# Altium schematic sheet 树莓派F1C100S.SchDoc
size A4
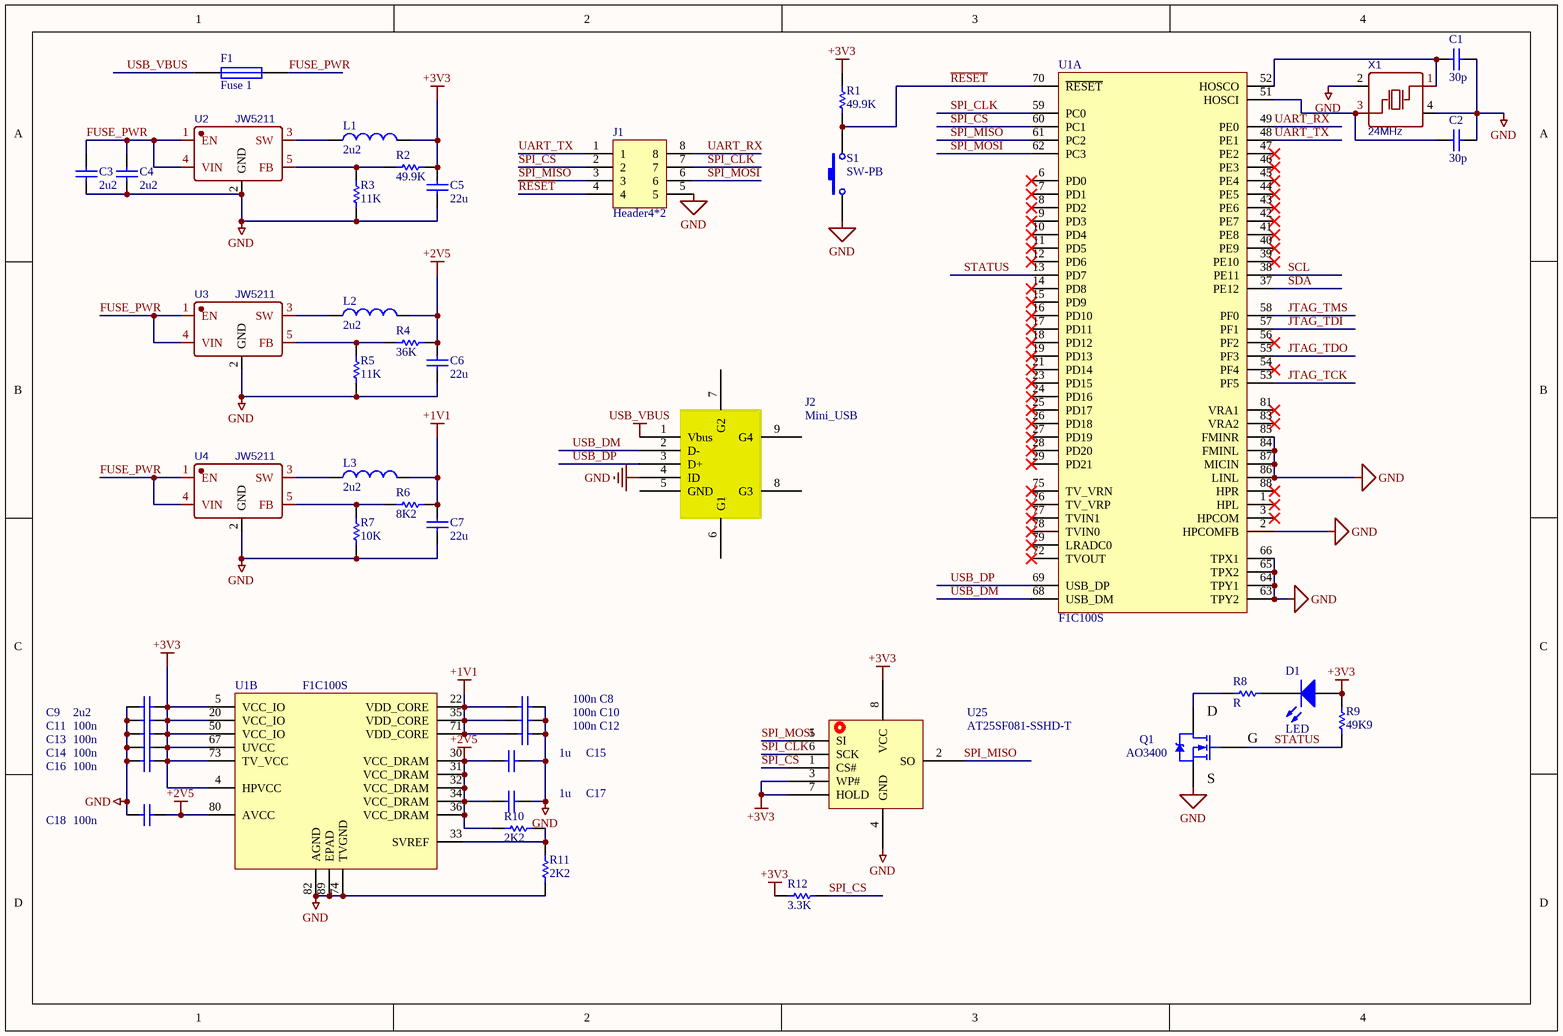
[diagram p0: 树莓派F1C100S.SchDoc]

## Parts
C1  30p  [C0805]
C2  30p  [C0805]
C3  2u2  [C0805]
C4  2u2  [C0805]
C5  22u  [C0805]
C6  22u  [C0805]
C7  22u  [C0805]
C8  100n  [C0805]
C9  2u2  [C0805]
C10  100n  [C0805]
C11  100n  [C0805]
C12  100n  [C0805]
C13  100n  [C0805]
C14  100n  [C0805]
C15  1u  [C0805]
C16  100n  [C0805]
C17  1u  [C0805]
C18  100n  [C0805]
D1  LED  [LED-0805]
F1  Fuse 1  [polyfuse]
J1  Header4*2  [HDR2X4]
J2  Mini_USB  [MINi_USB_2]
L1  2u2  [R0805]
L2  2u2  [R0805]
L3  2u2  [R0805]
Q1  AO3400  [SOT-23]
R1  49.9K  [R0805]
R2  49.9K  [R0805]
R3  11K  [R0805]
R4  36K  [R0805]
R5  11K  [R0805]
R6  8K2  [R0805]
R7  10K  [R0805]
R8  R  [R0805]
R9  49K9  [R0805]
R10  2K2  [R0805]
R11  2K2  [R0805]
R12  3.3K  [R0805]
S1  SW-PB  [SW-2]
U1  F1C100S  [QFN-88]  (parts A,B of 2)
U2  JW5211  [SOT-23-5]
U3  JW5211  [SOT-23-5]
U4  JW5211  [SOT-23-5]
U25  AT25SF081-SSHD-T  [AT25SF081-SSHD-T]
X1  24MHz  [5032_4P_24M]

## Nets
+1V1: C7.2 C8.1 C10.1 C12.1 L3.2 R6.1 U1.22(VDD_CORE) U1.35(VDD_CORE) U1.71(VDD_CORE)
+2V5: C6.2 C15.1 C17.1 C18.1 L2.2 R4.1 R10.2 U1.30(VCC_DRAM) U1.31(VCC_DRAM) U1.32(VCC_DRAM) U1.34(VCC_DRAM) U1.36(VCC_DRAM) U1.80(AVCC)
+3V3: C5.2 C9.1 C11.1 C13.1 C14.1 C16.1 D1.1(A) L1.2 R1.1 R2.1 R9.2 R12.1 U1.4(HPVCC) U1.5(VCC_IO) U1.20(VCC_IO) U1.50(VCC_IO) U1.67(UVCC) U1.73(TV_VCC) U25.3(WP#) U25.7(HOLD) U25.8(VCC)
GND: C1.2 C2.2 C3.1 C4.1 C5.1 C6.1 C7.1 C8.2 C9.2 C10.2 C11.2 C12.2 C13.2 C14.2 C15.2 C16.2 C17.2 C18.2 J1.5 J2.4(ID) Q1.2(S) R3.1 R5.1 R7.1 R11.2 S1.1 U1.2(HPCOMFB) U1.63(TPY2) U1.64(TPY1) U1.65(TPX2) U1.66(TPX1) U1.74(TVGND) U1.82(AGND) U1.84(FMINL) U1.85(FMINR) U1.86(LINL) U1.87(MICIN) U1.89(EPAD) U2.2(GND) U3.2(GND) U4.2(GND) U25.4(GND) X1.2 X1.4
USB_VBUS: F1.1 J2.1(Vbus)
FUSE_PWR: C3.2 C4.2 F1.2 U2.1(EN) U2.4(VIN) U3.1(EN) U3.4(VIN) U4.1(EN) U4.4(VIN)
JTAG_TCK: U1.53(PF5)
JTAG_TDI: U1.57(PF1)
JTAG_TDO: U1.55(PF3)
JTAG_TMS: U1.58(PF0)
~{RESET}: J1.4 R1.2 S1.2 U1.70(~{RESET})
SCL: U1.38(PE11)
SDA: U1.37(PE12)
SPI_CLK: J1.7 U1.59(PC0) U25.6(SCK)
SPI_CS: J1.2 R12.2 U1.60(PC1) U25.1(CS#)
SPI_MISO: J1.3 U1.61(PC2) U25.2(SO)
SPI_MOSI: J1.6 U1.62(PC3) U25.5(SI)
STATUS: Q1.1(G) R9.1 U1.13(PD7)
UART_RX: J1.8 U1.49(PE0)
UART_TX: J1.1 U1.48(PE1)
USB_DM: J2.2(D-) U1.68(USB_DM)
USB_DP: J2.3(D+) U1.69(USB_DP)
NetC1_1: C1.1 U1.52(HOSCO) X1.1(OSC1)
NetC2_1: C2.1 U1.51(HOSCI) X1.3(OSC2)
NetD1_2: D1.2(K) R8.2
NetL1_1: L1.1 U2.3(SW)
NetL2_1: L2.1 U3.3(SW)
NetL3_1: L3.1 U4.3(SW)
NetQ1_3: Q1.3(D) R8.1
NetR2_2: R2.2 R3.2 U2.5(FB)
NetR4_2: R4.2 R5.2 U3.5(FB)
NetR6_2: R6.2 R7.2 U4.5(FB)
NetR10_1: R10.1 R11.1 U1.33(SVREF)

Not connected (* = marked no-connect by the designer): J2 5(GND) 6(G1) 7(G2) 8(G3) 9(G4); U1 1(HPL)* 3(HPCOM)* 6(PD0)* 7(PD1)* 8(PD2)* 9(PD3)* 10(PD4)* 11(PD5)* 12(PD6)* 14(PD8)* 15(PD9)* 16(PD10)* 17(PD11)* 18(PD12)* 19(PD13)* 21(PD14)* 23(PD15)* 24(PD16)* 25(PD17)* 26(PD18)* 27(PD19)* 28(PD20)* 29(PD21)* 39(PE10)* 40(PE9)* 41(PE8)* 42(PE7)* 43(PE6)* 44(PE5)* 45(PE4)* 46(PE3)* 47(PE2)* 54(PF4)* 56(PF2)* 72(TVOUT)* 75(TV_VRN)* 76(TV_VRP)* 77(TVIN1)* 78(TVIN0)* 79(LRADC0)* 81(VRA1)* 83(VRA2)* 88(HPR)*

## Library data of the parts
C1-C18 = Cap: Capacitor; Value: 100pF; Published: 8-Jun-2000; LatestRevisionDate: 17-Jul-2002; LatestRevisionNote: Re-released for DXP Platform.; PackageReference: RAD-0.3; Publisher: Altium Limited; PackageDescription: Radial Cap, Thru-Hole; 2 Leads; 0.3 in Pin Spacing
D1 = LED0: Typical INFRARED GaAs LED; Published: 8-Jun-2000; LatestRevisionDate: 08-Jul-2005; LatestRevisionNote: Mech Layer 1 removed.; PackageReference: LED-0; Publisher: Altium Limited; PackageDescription: LED; 2 Leads
F1 = Fuse 1: Fuse; Published: 8-Jun-2000; LatestRevisionDate: 17-Jul-2002; LatestRevisionNote: Re-released for DXP Platform.; PackageReference: PIN-W2/E2.8; Publisher: Altium Limited; PackageDescription: Thru-Hole; 2 Leads
L1-L3 = Inductor: Code_IEC: 1005; Value: 10mH; Published: 8-Jun-2000; LatestRevisionDate: 29-May-2009; LatestRevisionNote: IPC-7351 Footprint Added.; PackageReference: 0402-A; Publisher: Altium Limited; PackageDescription: Chip Inductor; Code_JEITA: 0402
Q1 = AO3400: N-Channel Power MOSFET; Note: Pin 2 is electrically connected to pin 4.; Published: 8-Jun-2000; LatestRevisionDate: 17-Jul-2002; LatestRevisionNote: Re-released for DXP Platform.; DatasheetVersion: PD-9.814; PackageVersion: Feb-1997; PackageReference: TO-220AB; Publisher: Altium Limited; PackageDescription: TO, Thru-Hole, Vertical, Heatsink Mounted; 3 In-Line Leads; Pitch 2.54 mm; ComponentLink1Description: Manufacturer Link; ComponentLink1URL: http://www.irf.com/
R1-R12 = Res1: Resistor; Value: 1K; Published: 8-Jun-2000; LatestRevisionDate: 17-Jul-2002; LatestRevisionNote: Re-released for DXP Platform.; PackageReference: AXIAL-0.3; Publisher: Altium Limited; PackageDescription: Axial Device, Thru-Hole; 2 Leads; 0.3 in Pin Spacing
S1 = SW-PB: Switch; Published: 24-Mar-1999; LatestRevisionDate: 17-Jul-2002; LatestRevisionNote: Re-released for DXP Platform.; PackageReference: SPST-2; Publisher: Altium Limited
U1 = F1C100S: 树莓派 全志
U2-U4 = JW5211: BOM_Manufacturer: JoulWatt Tech; Contributor: LCSC; SMT Type: Extend; BOM_Supplier: LCSC; BOM_Supplier Part: C371423; BOM_Manufacturer Part: JW5211; BOM_LCSC Assembly: Yes; spicePre: U; spiceSymbolName: JW5211
X1 = 24MHz: BOM_Manufacturer: Nihon Dempa Kogyo; BOM_Manufacturer Part: NX3225GA-24MHZ(STD-CRG-2); nameAlias: Frequency; Contributor: LCSC; SMT Type: Extend; BOM_Supplier: LCSC; BOM_Supplier Part: C156248; BOM_LCSC Assembly: Yes; spicePre: X; spiceSymbolName: NX3225GA-24MHZ(STD-CRG-2)